# Altium schematic sheet 5-DisplayPort & Ethernet.SchDoc: DisplayPort & Ethernet
size B; CompanyName: NGRF; Address1: 2130 Howard Drive W; Address2: North Mankato, MN 56003; Address3: www.nextgenrf.com; Revision: 2; SheetNumber: 5; SheetTotal: 7; ProjName: BytePipe X9002_HDK
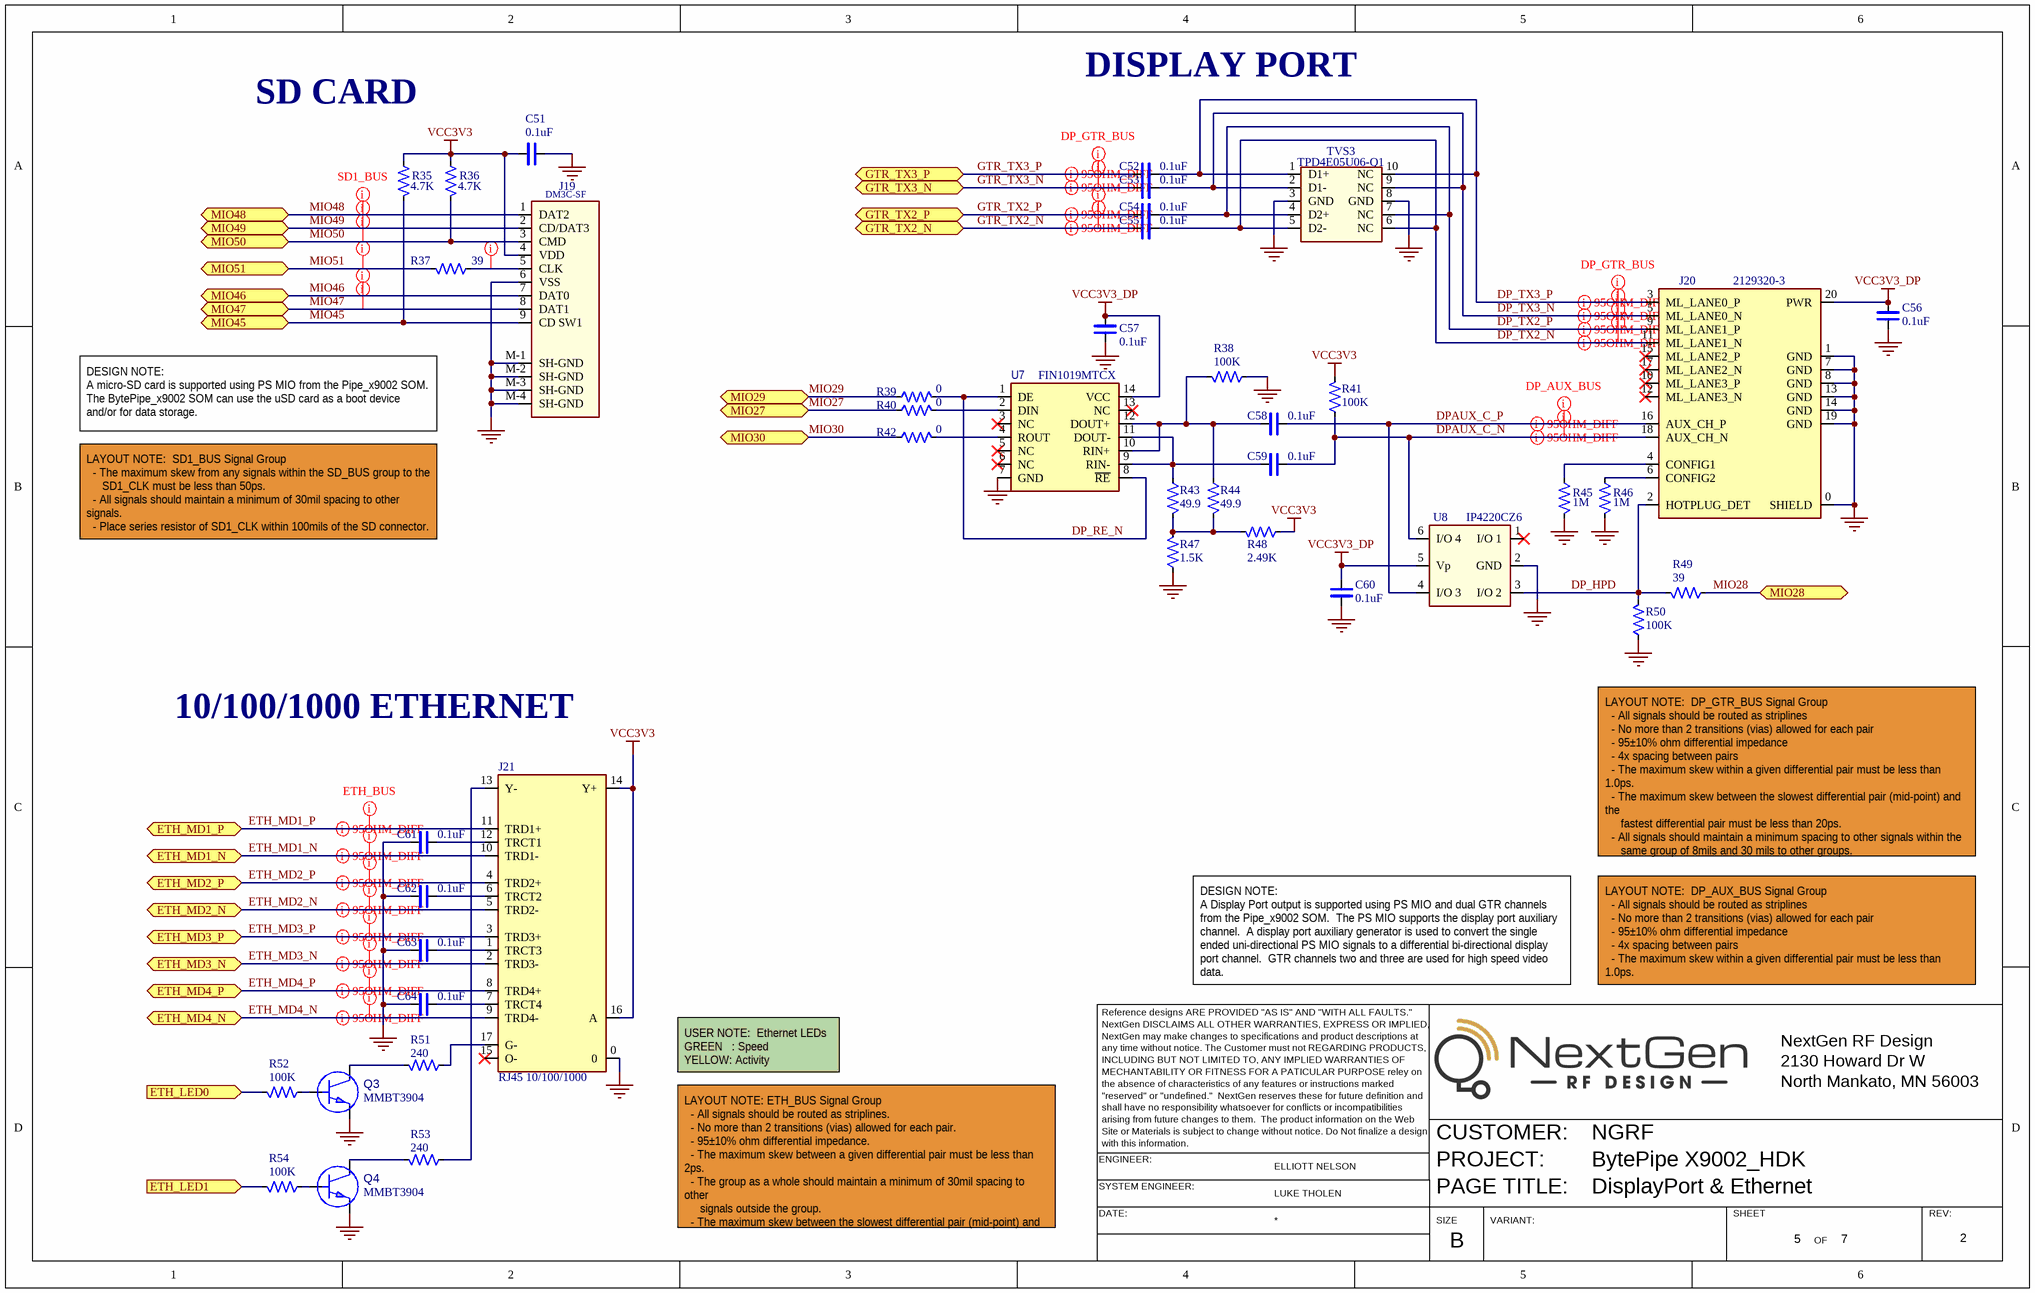
[diagram p0: 5-DisplayPort & Ethernet.SchDoc]

## Parts
C51  value 0.1uF  [SM/0402/CAP]  (hidden comment: CAP_CERAMIC_0402)
C52  value 0.1uF  [SM/0402/CAP]  (hidden comment: CAP_CERAMIC_0402)
C53  value 0.1uF  [SM/0402/CAP]  (hidden comment: CAP_CERAMIC_0402)
C54  value 0.1uF  [SM/0402/CAP]  (hidden comment: CAP_CERAMIC_0402)
C55  value 0.1uF  [SM/0402/CAP]  (hidden comment: CAP_CERAMIC_0402)
C56  value 0.1uF  [SM/0402/CAP]  (hidden comment: CAP_CERAMIC_0402)
C57  value 0.1uF  [SM/0402/CAP]  (hidden comment: CAP_CERAMIC_0402)
C58  value 0.1uF  [SM/0402/CAP]  (hidden comment: CAP_CERAMIC_0402)
C59  value 0.1uF  [SM/0402/CAP]  (hidden comment: CAP_CERAMIC_0402)
C60  value 0.1uF  [SM/0402/CAP]  (hidden comment: CAP_CERAMIC_0402)
C61  value 0.1uF  [SM/0402/CAP]  (hidden comment: CAP_CERAMIC_0402)
C62  value 0.1uF  [SM/0402/CAP]  (hidden comment: CAP_CERAMIC_0402)
C63  value 0.1uF  [SM/0402/CAP]  (hidden comment: CAP_CERAMIC_0402)
C64  value 0.1uF  [SM/0402/CAP]  (hidden comment: CAP_CERAMIC_0402)
J19  value DM3C-SF  [SM/CON/MICRO_SD-CARD/HOLDER]  (hidden comment: CONN MICRO SD CARD HINGED TYPE)
J20  value 2129320-3  [CON/TE/2129320-3]  (hidden comment: CON_TE_2129320-3)
J21  value RJ45 10/100/1000  [CON/RJ45/L829-1J1T-43]  (hidden comment: CON_RJ45_MagJack_L829-1J1T-43)
Q3  value MMBT3904  [SM/SOT23_A]  (hidden comment: TRANSISTOR_NPN_SOT23)
Q4  value MMBT3904  [SM/SOT23_A]  (hidden comment: TRANSISTOR_NPN_SOT23)
R35  value 4.7K  [SM/0402/RES]  (hidden comment: RES_0402_A)
R36  value 4.7K  [SM/0402/RES]  (hidden comment: RES_0402_A)
R37  value 39  [SM/0402/RES]  (hidden comment: RES_0402_A)
R38  value 100K  [SM/0402/RES]  (hidden comment: RES_0402_A)
R39  value 0  [SM/0402/RES]  (hidden comment: RES_0402_A)
R40  value 0  [SM/0402/RES]  (hidden comment: RES_0402_A)
R41  value 100K  [SM/0402/RES]  (hidden comment: RES_0402_A)
R42  value 0  [SM/0402/RES]  (hidden comment: RES_0402_A)
R43  value 49.9  [SM/0402/RES]  (hidden comment: RES_0402_A)
R44  value 49.9  [SM/0402/RES]  (hidden comment: RES_0402_A)
R45  value 1M  [SM/0402/RES]  (hidden comment: RES_0402_A)
R46  value 1M  [SM/0402/RES]  (hidden comment: RES_0402_A)
R47  value 1.5K  [SM/0402/RES]  (hidden comment: RES_0402_A)
R48  value 2.49K  [SM/0402/RES]  (hidden comment: RES_0402_A)
R49  value 39  [SM/0402/RES]  (hidden comment: RES_0402_A)
R50  value 100K  [SM/0402/RES]  (hidden comment: RES_0402_A)
R51  value 240  [SM/0402/RES]  (hidden comment: RES_0402_A)
R52  value 100K  [SM/0402/RES]  (hidden comment: RES_0402_A)
R53  value 240  [SM/0402/RES]  (hidden comment: RES_0402_A)
R54  value 100K  [SM/0402/RES]  (hidden comment: RES_0402_A)
TVS3  value TPD4E05U06-Q1  [SM/DFN10/2.5X1MM_A]  (hidden comment: TVS_TPD4E05U06_2.5mmX1mm)
U7  value FIN1019MTCX  [SM/TSSOP14_5X6.4MM_A]  (hidden comment: IC_FIN1019MTCX_TSSOP-14)
U8  value IP4220CZ6  [SM/TSOP-6_A]  (hidden comment: IC_IP4220CZ6_TSOP-6)

## Ports
ETH_LED0 (in), ETH_LED1 (in), ETH_MD1_N (bidir), ETH_MD1_P (bidir), ETH_MD2_N (bidir), ETH_MD2_P (bidir), ETH_MD3_N (bidir), ETH_MD3_P (bidir), ETH_MD4_N (bidir), ETH_MD4_P (bidir), GTR_TX2_N (bidir), GTR_TX2_P (bidir), GTR_TX3_N (bidir), GTR_TX3_P (bidir), MIO27 (bidir), MIO28 (bidir), MIO29 (bidir), MIO30 (bidir), MIO45 (bidir), MIO46 (bidir), MIO47 (bidir), MIO48 (bidir), MIO49 (bidir), MIO50 (bidir), MIO51 (bidir)

## Nets
GND: C51.2(N2) C56.2(N2) C57.2(N2) C60.2(N2) C61.1(N1) C62.1(N1) C63.1(N1) C64.1(N1) J19.6(VSS) J19.M-1(SH-GND) J19.M-2(SH-GND) J19.M-3(SH-GND) J19.M-4(SH-GND) J20.0(SHIELD) J20.1(GND) J20.7(GND) J20.8(GND) J20.13(GND) J20.14(GND) J20.19(GND) J21.0 Q3.2(E) Q4.2(E) R38.1 R45.2 R46.2 R47.1 R50.1 TVS3.3(GND) TVS3.8(GND) U7.7(GND) U8.2(GND)
VCC3V3: C51.1(N1) J19.4(VDD) J21.14(Y+) J21.16(A) R35.1 R36.1 R41.2 R48.1
VCC3V3_DP: C56.1(N1) C57.1(N1) C60.1(N1) J20.20(PWR) U7.14(VCC) U8.5(Vp)
DP_HPD: J20.2(HOTPLUG_DET) R49.2 R50.2 U8.3(I/O_2)
DP_RE_N: R39.1 U7.1(DE) U7.8(~{RE})
DP_TX2_N: C55.2(N2) J20.11(ML_LANE1_N) TVS3.5(D2-) TVS3.6(NC)
DP_TX2_P: C54.2(N2) J20.9(ML_LANE1_P) TVS3.4(D2+) TVS3.7(NC)
DP_TX3_N: C53.2(N2) J20.5(ML_LANE0_N) TVS3.2(D1-) TVS3.9(NC)
DP_TX3_P: C52.2(N2) J20.3(ML_LANE0_P) TVS3.1(D1+) TVS3.10(NC)
DPAUX_C_N: C59.2(N2) J20.18(AUX_CH_N) R41.1 U8.6(I/O_4)
DPAUX_C_P: C58.2(N2) J20.16(AUX_CH_P) U8.4(I/O_3)
ETH_LED0: R52.2 ; port ETH_LED0
ETH_LED1: R54.2 ; port ETH_LED1
ETH_MD1_N: J21.10(TRD1-) ; port ETH_MD1_N
ETH_MD1_P: J21.11(TRD1+) ; port ETH_MD1_P
ETH_MD2_N: J21.5(TRD2-) ; port ETH_MD2_N
ETH_MD2_P: J21.4(TRD2+) ; port ETH_MD2_P
ETH_MD3_N: J21.2(TRD3-) ; port ETH_MD3_N
ETH_MD3_P: J21.3(TRD3+) ; port ETH_MD3_P
ETH_MD4_N: J21.9(TRD4-) ; port ETH_MD4_N
ETH_MD4_P: J21.8(TRD4+) ; port ETH_MD4_P
GTR_TX2_N: C55.1(N1) ; port GTR_TX2_N
GTR_TX2_P: C54.1(N1) ; port GTR_TX2_P
GTR_TX3_N: C53.1(N1) ; port GTR_TX3_N
GTR_TX3_P: C52.1(N1) ; port GTR_TX3_P
MIO27: R40.2 ; port MIO27
MIO28: R49.1 ; port MIO28
MIO29: R39.2 ; port MIO29
MIO30: R42.2 ; port MIO30
MIO45: J19.9(CD_SW1) R35.2 ; port MIO45
MIO46: J19.7(DAT0) ; port MIO46
MIO47: J19.8(DAT1) ; port MIO47
MIO48: J19.1(DAT2) ; port MIO48
MIO49: J19.2(CD/DAT3) ; port MIO49
MIO50: J19.3(CMD) R36.2 ; port MIO50
MIO51: R37.2 ; port MIO51
NetC58_1: C58.1(N1) R38.2 R44.1 U7.10(RIN+) U7.12(DOUT+)
NetC59_1: C59.1(N1) R43.1 U7.9(RIN-) U7.11(DOUT-)
NetC61_2: C61.2(N2) J21.12(TRCT1)
NetC62_2: C62.2(N2) J21.6(TRCT2)
NetC63_2: C63.2(N2) J21.1(TRCT3)
NetC64_2: C64.2(N2) J21.7(TRCT4)
NetJ19_5: J19.5(CLK) R37.1
NetJ20_4: J20.4(CONFIG1) R45.1
NetJ20_6: J20.6(CONFIG2) R46.1
NetJ21_13: J21.13(Y-) R53.2
NetJ21_17: J21.17(G-) R51.2
NetQ3_1: Q3.1(B) R52.1
NetQ3_3: Q3.3(C) R51.1
NetQ4_1: Q4.1(B) R54.1
NetQ4_3: Q4.3(C) R53.1
NetR40_1: R40.1 U7.2(DIN)
NetR42_1: R42.1 U7.4(ROUT)
NetR43_2: R43.2 R44.2 R47.2 R48.2

Not connected (* = marked no-connect by the designer): J20 10(ML_LANE3_P)* 12(ML_LANE3_N)* 15(ML_LANE2_P)* 17(ML_LANE2_N)*; J21 15(O-)*; U7 3(NC)* 5(NC)* 6(NC)* 13(NC)*; U8 1(I/O_1)*

## Layout directives
net class DP_GTR_BUS: DP_TX2_N, DP_TX2_P, DP_TX3_N, DP_TX3_P, GTR_TX2_N, GTR_TX2_P, GTR_TX3_N, GTR_TX3_P
net class DP_AUX_BUS: DPAUX_C_N, DPAUX_C_P
differential pair; Impedance: 90 Ohms; differential pair class 95OHM_DIFF: DP_TX2_N, DP_TX2_P, DP_TX3_N, DP_TX3_P, DPAUX_C_N, DPAUX_C_P, ETH_MD1_N, ETH_MD1_P, ETH_MD2_N, ETH_MD2_P, ETH_MD3_N, ETH_MD3_P, ETH_MD4_N, ETH_MD4_P, GTR_TX2_N, GTR_TX2_P, GTR_TX3_N, GTR_TX3_P
net class ETH_BUS: ETH_MD1_N, ETH_MD1_P, ETH_MD2_N, ETH_MD2_P, ETH_MD3_N, ETH_MD3_P, ETH_MD4_N, ETH_MD4_P
net class SD1_BUS: MIO46, MIO47, MIO48, MIO49, MIO50, MIO51, NetJ19_5

## Notes on the sheet
- DISPLAY PORT
- SD CARD
- DESIGN NOTE:
  A micro-SD card is supported using PS MIO from the Pipe_x9002 SOM.  The BytePipe_x9002 SOM can use the uSD card as a boot device and/or for data storage.
- LAYOUT NOTE:  SD1_BUS Signal Group
  - The maximum skew from any signals within the SD_BUS group to the
  SD1_CLK must be less than 50ps.
  - All signals should maintain a minimum of 30mil spacing to other signals.
  - Place series resistor of SD1_CLK within 100mils of the SD connector.
  -MIO51 is SD1_CLK.
- 10/100/1000 ETHERNET
- (near R50) LAYOUT NOTE:  DP_GTR_BUS Signal Group
  - All signals should be routed as striplines
  - No more than 2 transitions (vias) allowed for each pair
  - 95±10% ohm differential impedance
  - 4x spacing between pairs
  - The maximum skew within a given differential pair must be less than 1.0ps.
  - The maximum skew between the slowest differential pair (mid-point) and the
  fastest differential pair must be less than 20ps.
  - All signals should maintain a minimum spacing to other signals within the
  same group of 8mils and 30 mils to other groups.
  - All signals within the group should be routed on the same layer.
- Reference designs ARE PROVIDED "AS IS" AND "WITH ALL FAULTS."
- NextGen DISCLAIMS ALL OTHER WARRANTIES, EXPRESS OR IMPLIED,
- NextGen may make changes to specifications and product descriptions at
- DESIGN NOTE:
  A Display Port output is supported using PS MIO and dual GTR channels from the Pipe_x9002 SOM.  The PS MIO supports the display port auxiliary channel.  A display port auxiliary generator is used to convert the single ended uni-directional PS MIO signals to a differential bi-directional display port channel.  GTR channels two and three are used for high speed video data.
- LAYOUT NOTE:  DP_AUX_BUS Signal Group
  - All signals should be routed as striplines
  - No more than 2 transitions (vias) allowed for each pair
  - 95±10% ohm differential impedance
  - 4x spacing between pairs
  - The maximum skew within a given differential pair must be less than 1.0ps.
- NextGen RF Design
- USER NOTE:  Ethernet LEDs
  GREEN   : Speed
  YELLOW: Activity
- any time without notice. The Customer must not REGARDING PRODUCTS,
- INCLUDING BUT NOT LIMITED TO, ANY IMPLIED WARRANTIES OF
- MECHANTABILITY OR FITNESS FOR A PATICULAR PURPOSE reley on
- "reserved" or "undefined."  NextGen reserves these for future definition and
- the absence of characteristics of any features or instructions marked
- shall have no responsibility whatsoever for conflicts or incompatibilities
- 2130 Howard Dr W
- North Mankato, MN 56003
- ENGINEER:
- Site or Materials is subject to change without notice. Do Not finalize a design
- with this information.
- arising from future changes to them.  The product information on the Web
- ELLIOTT NELSON
- CUSTOMER:
- PROJECT:
- LAYOUT NOTE: ETH_BUS Signal Group
  - All signals should be routed as striplines.
  - No more than 2 transitions (vias) allowed for each pair.
  - 95±10% ohm differential impedance.
  - The maximum skew between a given differential pair must be less than 2ps.
  - The group as a whole should maintain a minimum of 30mil spacing to other
  signals outside the group.
  - The maximum skew between the slowest differential pair (mid-point) and the
  fastest differential pair of the signal group must be less than 10ps.
- SYSTEM ENGINEER:
- DATE:
- LUKE THOLEN
- SIZE
- PAGE TITLE:
- VARIANT:
- SHEET
- OF
- REV:
- B

## Library data of the parts
C51-C64 = CAP_CERAMIC_0402: CAP CER 0.1UF 25V X7R 0402; TOL: ±10%; OEM#: CL05B104KA5NNNC; OEM NAME: Samsung; VOLT: 25V
J19 = CON_HIROSE_MICRO-SD_HINGED: 10 (8 + 2) Position Card Connector Secure Digital - microSD™ Surface Mount, Right Angle Gold; OEM NAME: Hirose Electric Co Ltd; OEM#: DM3C-SF
J20 = CON_TE_2129320-3: DisplayPort, Mini  Receptacle Connector 20 Position Through Hole, Right Angle..; OEM NAME: TE; OEM#: 2129320-3
J21 = CON_RJ45_MagJack_L829-1J1T-43: 1 Port RJ45 Magjack Connector Through Hole 10/100/1000 Base-T, AutoMDIX; OEM NAME: Bel Fuse Inc; OEM#: L829-1J1T-43
Q3 Q4 = TRANSISTOR_NPN_SOT23: Bipolar (BJT) Transistor NPN 40V 200mA 300MHz 300mW Surface Mount SOT-23-3 (TO-236); OEM#: MMBT3904LT1G; OEM NAME: ON Semiconductor
R35 R36 = RES_0402_A: RES SMD 4.7K OHM 1% 1/10W 0402; OEM#: ERJ-2RKF4701X; OEM NAME: Panasonic; TOL: 1%
R37 R49 = RES_0402_A: RES SMD 39 OHM 1% 1/10W 0402; OEM#: ERJ-2RKF39R0X; OEM NAME: Panasonic; TOL: 1%
R38 R41 R50 R52 R54 = RES_0402_A: RES SMD 100K OHM 1% 1/10W 0402; OEM#: ERJ-2RKF1003X; OEM NAME: Panasonic; TOL: 1%
R39 R40 R42 = RES_0402_A: RES SMD 0 OHM JUMPER 1/10W 0402; OEM#: ERJ-2GE0R00X; OEM NAME: Panasonic; TOL: 1%
R43 R44 = RES_0402_A: RES 49.9 OHM 1% 1/10W 0402; OEM#: ERJ-2RKF49R9X; OEM NAME: Panasonic; TOL: ±1%
R45 R46 = RES_0402_A: RES SMD 1M OHM 1% 1/10W 0402; OEM#: ERJ-2RKF1004X; OEM NAME: Panasonic; TOL: ±1%
R47 = RES_0402_A: RES SMD 1.5K OHM 1% 1/10W 0402; OEM#: ERJ-2RKF1501X; OEM NAME: Panasonic; TOL: ±1%
R48 = RES_0402_A: RES SMD 2.49K OHM 1% 1/10W 0402; OEM#: ERJ-2RKF2491X; OEM NAME: Panasonic; TOL: ±1%
R51 R53 = RES_0402_A: RES SMD 240 OHM 1% 1/10W 0402; OEM#: ERJ-2RKF2400X; OEM NAME: Panasonic; TOL: 1%
TVS3 = TVS_TPD4E05U06_2.5mmX1mm: TVS DIODE 5.5V 14V 10SON; OEM NAME: TI; OEM#: TPD4E05U06-Q1
U7 = IC_FIN1019MTCX_TSSOP-14: 1/1 Transceiver Full LVDS 14-TSSOP; OEM NAME: ON Semiconductor; OEM#: FIN1019MTCX
U8 = IC_IP4220CZ6_TSOP-6: Dual USB ESD Protection; OEM#: IP4220CZ6,125; OEM NAME: NXP